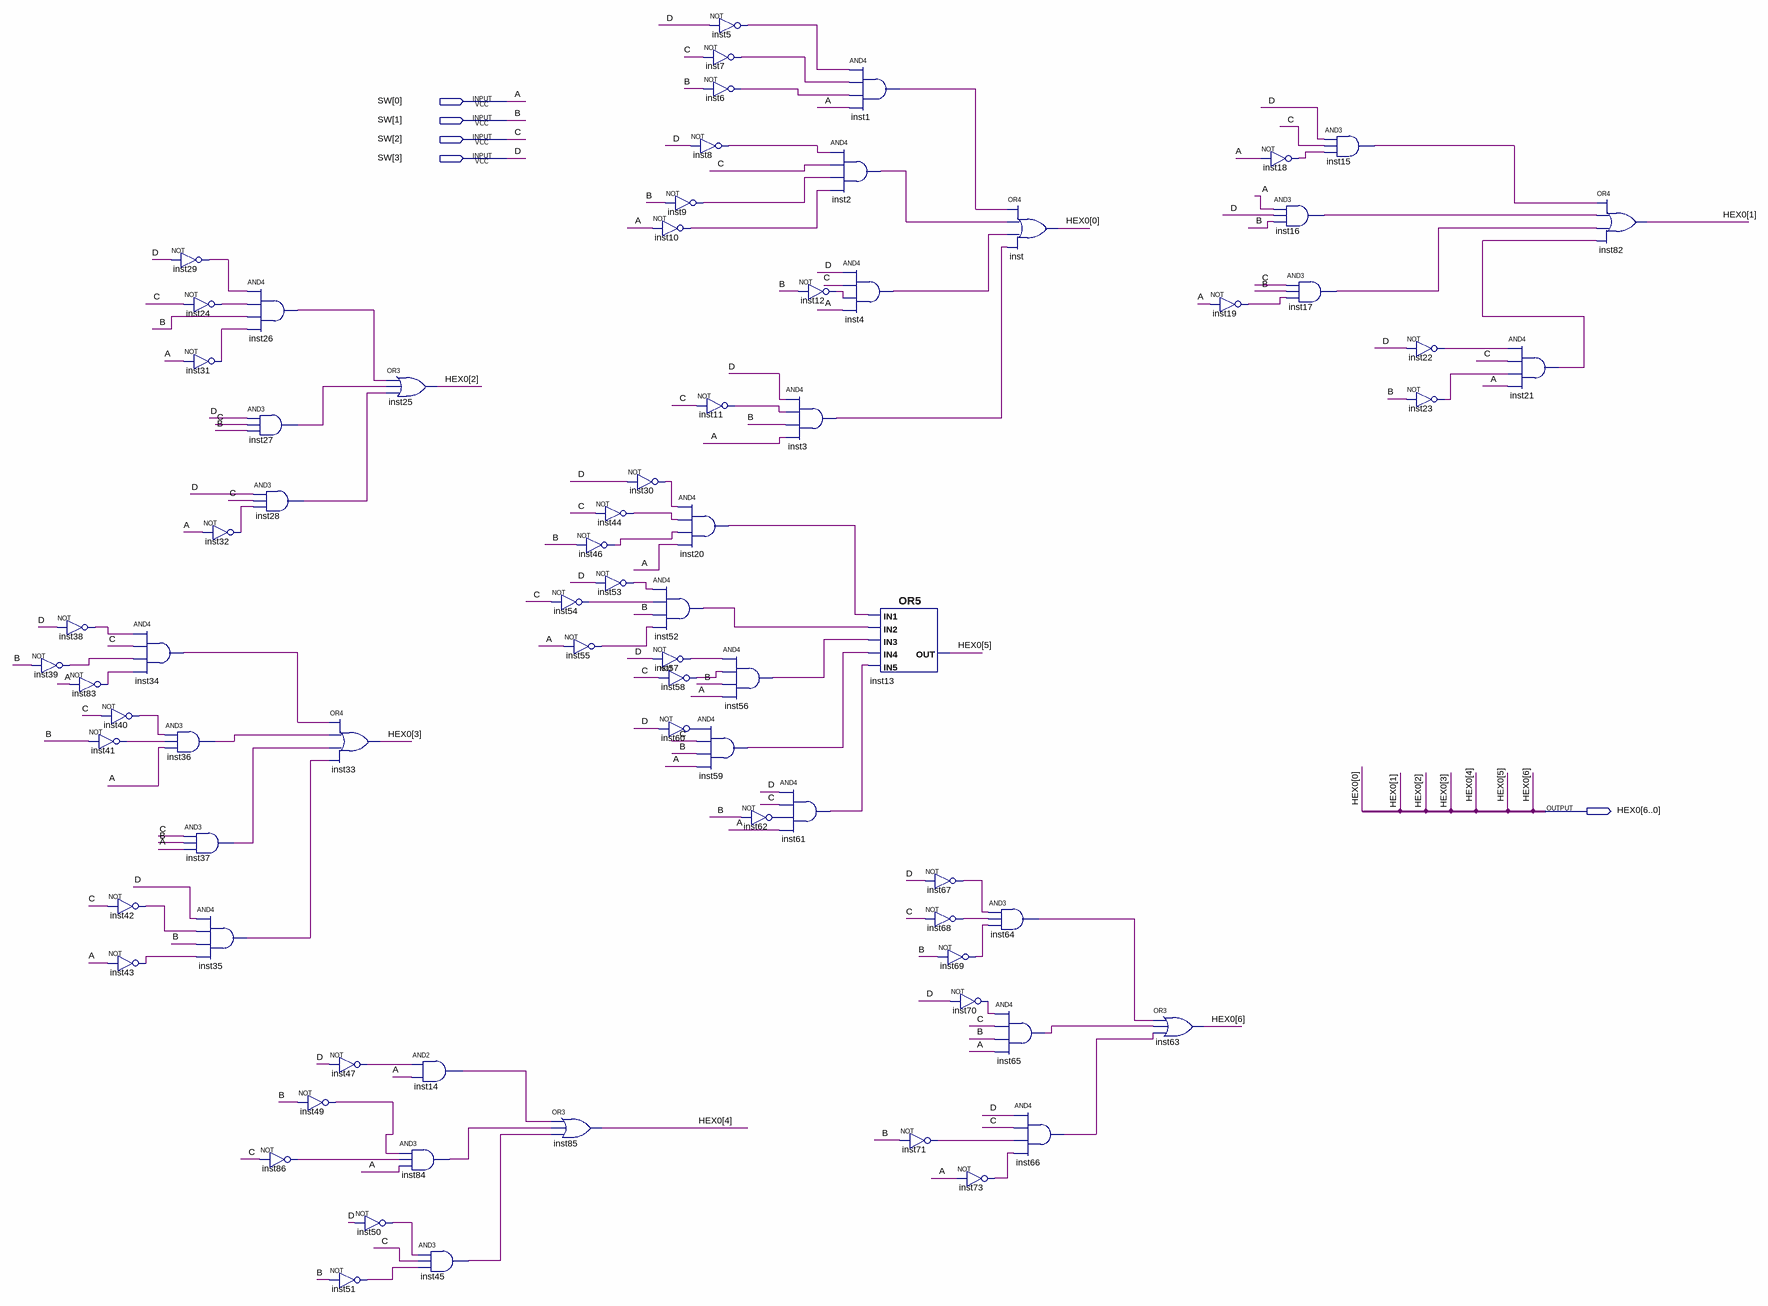
[diagram p0: schematic sheet]
// Quartus schematic hexadecimal.bdf as structural Verilog: 77 symbols, 5 pins
module hexadecimal (
  input  [3:0] SW,
  output [6:0] HEX0
);

  wire inst1_out, inst2_out, inst3_out, inst4_out, inst5_out, inst6_out, inst7_out, inst8_out, inst9_out,
       inst10_out, inst11_out, inst12_out, inst14_out, inst15_out, inst16_out, inst17_out, inst18_out,
       inst19_out, inst20_out, inst21_out, inst22_out, inst23_out, inst24_out, inst26_out, inst27_out,
       inst28_out, inst29_out, inst30_out, inst31_out, inst32_out, inst34_out, inst35_out, inst36_out,
       inst37_out, inst38_out, inst39_out, inst40_out, inst41_out, inst42_out, inst43_out, inst44_out,
       inst45_out, inst46_out, inst47_out, inst49_out, inst50_out, inst51_out, inst52_out, inst53_out,
       inst54_out, inst55_out, inst56_out, inst57_out, inst58_out, inst59_out, inst60_out, inst61_out,
       inst62_out, inst64_out, inst65_out, inst66_out, inst67_out, inst68_out, inst69_out, inst70_out,
       inst71_out, inst73_out, inst83_out, inst84_out, inst86_out;

  not inst39 (inst39_out, SW[1]);
  not inst38 (inst38_out, SW[3]);
  not inst83 (inst83_out, SW[0]);
  not inst40 (inst40_out, SW[2]);
  not inst41 (inst41_out, SW[1]);
  and inst34 (inst34_out, inst38_out, SW[2], inst39_out, inst83_out);
  not inst42 (inst42_out, SW[2]);
  not inst43 (inst43_out, SW[0]);
  not inst29 (inst29_out, SW[3]);
  not inst24 (inst24_out, SW[2]);
  not inst31 (inst31_out, SW[0]);
  not inst32 (inst32_out, SW[0]);
  and inst36 (inst36_out, inst40_out, inst41_out, SW[0]);
  and inst37 (inst37_out, SW[2], SW[1], SW[0]);
  and inst35 (inst35_out, SW[3], inst42_out, SW[1], inst43_out);
  and inst26 (inst26_out, inst29_out, inst24_out, SW[1], inst31_out);
  and inst27 (inst27_out, SW[3], SW[2], SW[1]);
  and inst28 (inst28_out, SW[3], SW[2], inst32_out);
  not inst49 (inst49_out, SW[1]);
  not inst86 (inst86_out, SW[2]);
  or inst33 (HEX0[3], inst34_out, inst36_out, inst37_out, inst35_out);
  not inst47 (inst47_out, SW[3]);
  not inst50 (inst50_out, SW[3]);
  not inst51 (inst51_out, SW[1]);
  or inst25 (HEX0[2], inst26_out, inst27_out, inst28_out);
  and inst84 (inst84_out, inst49_out, inst86_out, SW[0]);
  and inst14 (inst14_out, inst47_out, SW[0]);
  and inst45 (inst45_out, inst50_out, SW[2], inst51_out);
  not inst54 (inst54_out, SW[2]);
  or inst85 (HEX0[4], inst14_out, inst84_out, inst45_out);
  not inst44 (inst44_out, SW[2]);
  not inst46 (inst46_out, SW[1]);
  not inst53 (inst53_out, SW[3]);
  not inst55 (inst55_out, SW[0]);
  not inst10 (inst10_out, SW[0]);
  not inst30 (inst30_out, SW[3]);
  and inst52 (inst52_out, inst53_out, inst54_out, SW[1], inst55_out);
  not inst57 (inst57_out, SW[3]);
  not inst58 (inst58_out, SW[2]);
  not inst60 (inst60_out, SW[3]);
  not inst5 (inst5_out, SW[3]);
  not inst7 (inst7_out, SW[2]);
  not inst6 (inst6_out, SW[1]);
  not inst8 (inst8_out, SW[3]);
  not inst9 (inst9_out, SW[1]);
  not inst11 (inst11_out, SW[2]);
  and inst20 (inst20_out, inst30_out, inst44_out, inst46_out, SW[0]);
  and inst59 (inst59_out, inst60_out, SW[2], SW[1], SW[0]);
  and inst56 (inst56_out, inst57_out, inst58_out, SW[1], SW[0]);
  not inst62 (inst62_out, SW[1]);
  not inst12 (inst12_out, SW[1]);
  and inst3 (inst3_out, SW[3], inst11_out, SW[1], SW[0]);
  and inst61 (inst61_out, SW[3], SW[2], inst62_out, SW[0]);
  and inst1 (inst1_out, inst5_out, inst7_out, inst6_out, SW[0]);
  and inst2 (inst2_out, inst8_out, SW[2], inst9_out, inst10_out);
  and inst4 (inst4_out, SW[3], SW[2], inst12_out, SW[0]);
  or inst13 (HEX0[5], inst20_out, inst52_out, inst56_out, inst59_out, inst61_out);
  not inst71 (inst71_out, SW[1]);
  not inst67 (inst67_out, SW[3]);
  not inst68 (inst68_out, SW[2]);
  not inst69 (inst69_out, SW[1]);
  not inst70 (inst70_out, SW[3]);
  not inst73 (inst73_out, SW[0]);
  or inst (HEX0[0], inst1_out, inst2_out, inst4_out, inst3_out);
  and inst64 (inst64_out, inst67_out, inst68_out, inst69_out);
  and inst65 (inst65_out, inst70_out, SW[2], SW[1], SW[0]);
  and inst66 (inst66_out, SW[3], SW[2], inst71_out, inst73_out);
  or inst63 (HEX0[6], inst64_out, inst65_out, inst66_out);
  not inst19 (inst19_out, SW[0]);
  not inst18 (inst18_out, SW[0]);
  and inst16 (inst16_out, SW[0], SW[3], SW[1]);
  and inst17 (inst17_out, SW[2], SW[1], inst19_out);
  and inst15 (inst15_out, SW[3], SW[2], inst18_out);
  not inst22 (inst22_out, SW[3]);
  not inst23 (inst23_out, SW[1]);
  and inst21 (inst21_out, inst22_out, SW[2], inst23_out, SW[0]);
  or inst82 (HEX0[1], inst15_out, inst16_out, inst17_out, inst21_out);

  // Other names for the same wires on the sheet: A = SW[0]; B = SW[1]; C = SW[2]; D = SW[3]
endmodule
